# EAGLE design power_board (EAGLE 9.1.1)
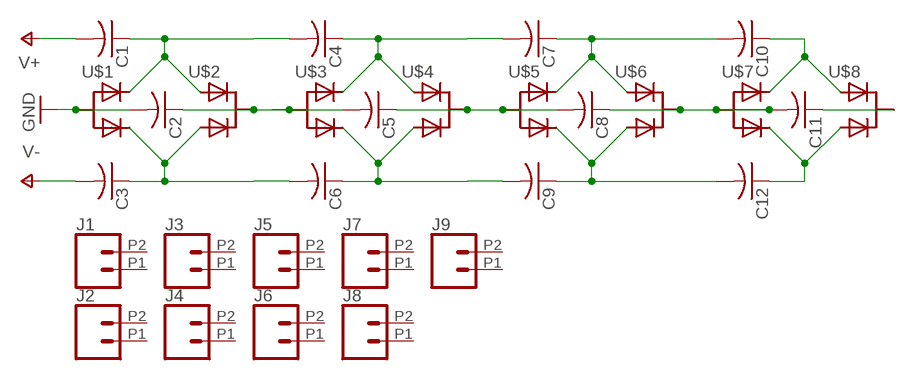
[diagram p0: schematic, sheet 1]

## Parts
C1  C-USC1206  [C1206]
C2  C-USC1206  [C1206]
C3  C-USC1206  [C1206]
C4  C-USC1206  [C1206]
C5  C-USC1206  [C1206]
C6  C-USC1206  [C1206]
C7  C-USC1206  [C1206]
C8  C-USC1206  [C1206]
C9  C-USC1206  [C1206]
C10  C-USC1206  [C1206]
C11  C-USC1206  [C1206]
C12  C-USC1206  [C1206]
J1  CONN_022.54MM_SCREWTERM  [1X02_2.54_SCREWTERM]
J2  CONN_022.54MM_SCREWTERM  [1X02_2.54_SCREWTERM]
J3  CONN_022.54MM_SCREWTERM  [1X02_2.54_SCREWTERM]
J4  CONN_022.54MM_SCREWTERM  [1X02_2.54_SCREWTERM]
J5  CONN_022.54MM_SCREWTERM  [1X02_2.54_SCREWTERM]
J6  CONN_022.54MM_SCREWTERM  [1X02_2.54_SCREWTERM]
J7  CONN_022.54MM_SCREWTERM  [1X02_2.54_SCREWTERM]
J8  CONN_022.54MM_SCREWTERM  [1X02_2.54_SCREWTERM]
J9  CONN_022.54MM_SCREWTERM  [1X02_2.54_SCREWTERM]
U$1  BAT54AT  [SOT23]
U$2  BAT54CT  [SOT23]
U$3  BAT54AT  [SOT23]
U$4  BAT54CT  [SOT23]
U$5  BAT54AT  [SOT23]
U$6  BAT54CT  [SOT23]
U$7  BAT54AT  [SOT23]
U$8  BAT54CT  [SOT23]

## Nets
GND: C2.2 U$1.3(A)
GND1: C2.1 C5.2 U$2.3(K) U$3.3(A)
GND2: C5.1 C8.2 U$4.3(K) U$5.3(A)
GND3: C8.1 C11.2 U$6.3(K) U$7.3(A)
N$1: C7.1 C10.2 U$5.2(K1) U$6.1(A1)
N$2: C9.1 C12.2 U$5.1(K2) U$6.2(A2)
N$4: C10.1 U$7.2(K1) U$8.1(A1)
N$5: C12.1 U$7.1(K2) U$8.2(A2)
N$6: C11.1 U$8.3(K)
V+: C1.2
V+1: C1.1 C4.2 U$1.2(K1) U$2.1(A1)
V+2: C4.1 C7.2 U$3.2(K1) U$4.1(A1)
V-: C3.2
V-1: C3.1 C6.2 U$1.1(K2) U$2.2(A2)
V-2: C6.1 C9.2 U$3.1(K2) U$4.2(A2)
Unconnected: J1.P1 J1.P2 J2.P1 J2.P2 J3.P1 J3.P2 J4.P1 J4.P2 J5.P1 J5.P2 J6.P1 J6.P2 J7.P1 J7.P2 J8.P1 J8.P2 J9.P1 J9.P2

## Library data of the parts
C1-C12 = resistor:C-US: CAPACITOR, American symbol
J1-J9 = SparkFun-Connectors:CONN_02: Multi connection point. Often used as Generic Header-pin footprint for 0.1 inch spaced/style header connections On any of the 0.1 inch spaced packages, you can populate with these: Break Away Headers - Straight <https://www.sparkfun.com/products/116> (PRT-00116) Break Away Male Headers - Right Angle <https://www.sparkfun.com/products/553> (PRT-00553) Female Headers <https://www.sparkfun.com/products/115> (PRT-00115) Break Away Headers - Machine Pin <https://www.sparkfun.com/products/117> (PRT-00117) Break Away Female Headers - Swiss Machine Pin <https://www.sparkfun.com/products/743> (PRT-00743) For SCREWTERMINALS and SPRING TERMINALS visit here: Screw Terimnals on SparkFun.com <https://www.sparkfun.com/search/results?term=Screw+Terminals> (5mm/3.5mm/2.54mm spacing) This device is also useful as a general connection point to wire up your design to another part of your project. Our various solder wires solder well into these plated through hole pads. Hook-Up Wire - Assortment (Stranded, 22 AWG) <https://www.sparkfun.com/products/11375> (PRT-11375) Hook-Up Wire - Assortment (Solid Core, 22 AWG) <https://www.sparkfun.com/products/11367> (PRT-11367) View the entire wire category on our website here <https://www.sparkfun.com/categories/141> Special notes: Molex polarized connector foot print use with: PRT-08233 with associated crimp pins and housings. 2.54_SCREWTERM for use with PRT-10571. 3.5mm Screw Terminal footprints for PRT-08084 5mm Screw Terminal footprints for use with PRT-08432
U$1 U$3 U$5 U$7 = tide_clock:BAT54AT
U$2 U$4 U$6 U$8 = tide_clock:BAT54CT

## Net classes
0 default: clearance 0.205 mm

## Board
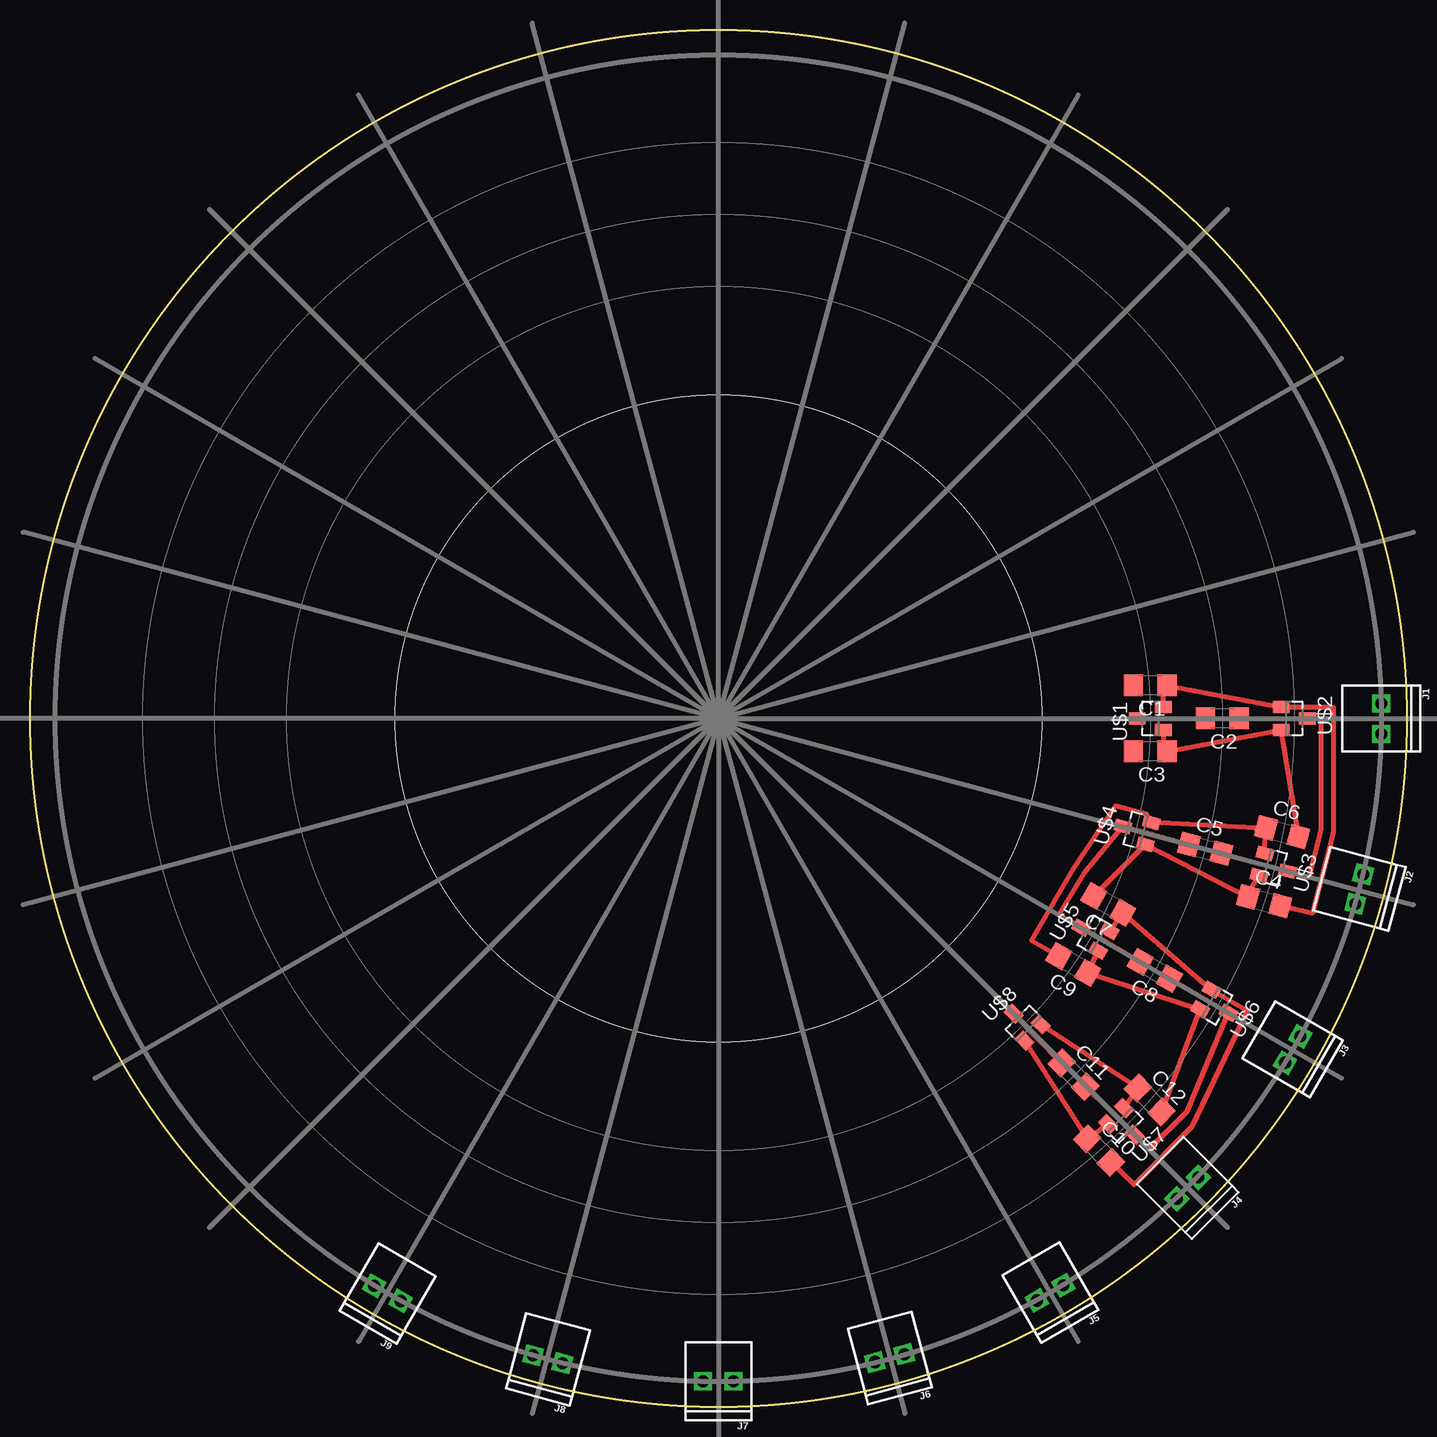
[diagram p1: board, top side]

Size 114.78 x 114.78 mm. Coordinates in mm from the lower left corner, seen from the top.
Outline: circle at 57.39,57.39 radius 57.39
Copper layers (1*16): Top 0.035mm / dielectric 1.5mm / Bottom 0.035mm
Design rules "default": minimum track width 6mil, minimum drill 0.35mm, track to track 6mil, track to pad 6mil, pad to pad 6mil, via to via 6mil, smd to smd 6mil, copper to edge 40mil, drill to drill 6mil, minimum pad ring 10mil, minimum via ring 8mil, stop-mask expansion 4mil, vias tented up to drill 0mil, thermal gap 10mil
Holes 53.88 mm at 57.39,57.39

### Footprints (pad centres in the part's own frame; a part is rotated, then mirrored left to right if it is on the bottom)
C1206 = smd 1.6 x 1.8: 1 -1.4,0; 2 1.4,0
1X02_2.54_SCREWTERM = drill 1.016 square: P1 2.54,0; P2 0,0
SOT23 = smd 1 x 1.4: 1 -0.95,-1.1; 2 0.95,-1.1; 3 0,1.1

### Placement (x,y rotation side)
C1  93.39,60.14 180 top
C2  99.39,57.39 180 top
C3  93.39,54.64 180 top
C4  102.89,42.14 345 top
C5  97.97,46.52 345 top
C6  104.39,47.89 345 top
C7  89.89,41.89 150 top
C8  93.77,36.4 150 top
C9  86.97,36.88 150 top
C10  89.11,21.37 315 top
C11  86.99,27.69 315 top
C12  93.34,25.59 315 top
J1  112.64,58.64 270 top
J2  111.14,44.39 255 top
J3  105.89,30.89 240 top
J4  97.39,19.14 225 top
J5  86.14,10.14 210 top
J6  72.89,4.39 195 top
J7  58.64,2.14 180 top
J8  44.39,3.64 165 top
J9  30.89,8.82 150 top
U$1  93.39,57.39 90 top
U$2  105.39,57.39 270 top
U$3  103.77,44.94 255 top
U$4  92.17,48.09 75 top
U$5  88.58,39.4 60 top
U$6  98.96,33.4 240 top
U$7  91.31,23.46 225 top
U$8  82.79,31.99 45 top

### Tracks (layer width: path | path; a pad name or v marks a point on that pad's centre or on a via)
GND
  Top 0.406: U$1.3 C2.2
GND1
  Top 0.406: C2.1 U$2.3 107.64,57.39 107.64,48.14 106.64,44.14 U$3.3 C5.2
GND2
  Top 0.406: C5.1 U$4.3 87.89,44.49 85.79,40.99 U$5.3 C8.2
GND3
  Top 0.406: C11.2 U$7.3 93.29,21.46 96.47,24.62 U$6.3 C8.1
N$1
  Top 0.406: U$5.2 C7.1 U$6.1 101.49,33.04 96.83,23.28 92.05,18.52 C10.2
N$2
  Top 0.406: U$5.1 C9.1 U$6.2 C12.2
N$4
  Top 0.406: U$7.2 C10.1 U$8.1
N$5
  Top 0.406: U$7.1 C12.1 U$8.2
N$6
  Top 0.406: C11.1 U$8.3
V+1
  Top 0.406: U$1.2 94.49,60.14 C1.1 U$2.1 108.64,58.34 108.64,47.89 106.89,41.14 C4.2
V+2
  Top 0.406: U$3.2 101.54,42.76 C4.1 101.47,42.5 U$4.1 C7.2
V-1
  Top 0.406: U$1.1 94.49,54.64 C3.1 U$2.2 C6.2
V-2
  Top 0.406: U$3.1 103,48.21 C6.1 102.14,48.25 U$4.2 93.09,49.39 90.49,50.09 86.99,44.89 83.49,38.89 C9.2